# Altium schematic sheet Power.SchDoc: QUTMS Shutdown V2 - Power
size A4; Author: Jonn Dillon; Organization: QUT Motorsport; Address1: O-120; Address2: O Block; Address3: QUT Gardens Point; Address4: Brisbane, 4000; DocumentNumber: 13; SheetNumber: 13; SheetTotal: 13
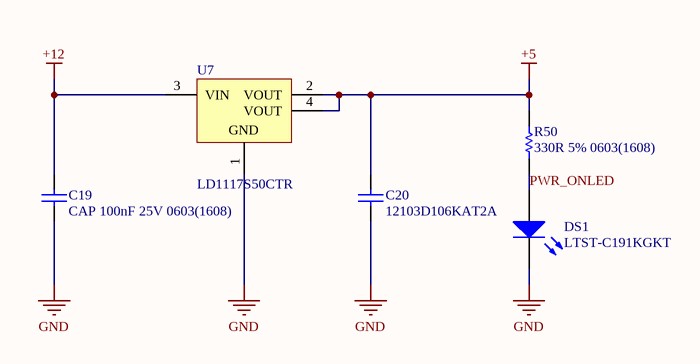
[diagram p0: Power.SchDoc]

## Parts
C19  CAP 100nF 25V 0603(1608)  [CAPC0603(1608)100_N]
C20  12103D106KAT2A  [CAPC3225X279X50LL20T25]
DS1  LTST-C191KGKT  [LITE-ON-LTST-C191KRKT-2_V]
R50  330R 5% 0603(1608)  [RESC0603(1608)_L]
U7  LD1117S50CTR  [SOT-223_N]

## Nets
+5: C20.2 R50.1 U7.2(VOUT) U7.4(VOUT)
+12: C19.2 U7.3(VIN)
GND: C19.1 C20.1 DS1.2(K) U7.1(GND)
PWR_ONLED: DS1.1(A) R50.2

## Notes on the sheet
- Title
- Size:
- Date:
- A4
- Number:
- Time:
- Revision:
- Sheet
- of
- File:

## Library data of the parts
C19 = CMP-1035-02587-1: CAP 100nF 25V ±5% 0603 (1608 Metric) Thickness 1mm SMD; Case-EIA: 0603; Tolerance: Â±5%; Case-Metric: 1608; Technology: SMT; Max Thickness: 1 mm; Rated Voltage: 25 V; Value: 100nF
C20 = CMP-2000-05477-1: Chip Capacitor, 10 uF, +/- 10%, 25 V, -55 to 85 degC, 1210 (3225 Metric), RoHS, Tape and Reel; Manufacturer: AVX; Product Training Modules: ComponentSolutionsforSmartMeterApplications; Capacitance: 10µF; Catalog Drawings: AT2A_1210_2.79; Voltage - Rated: 25V; Other Names: 478-1627-6; Online Catalog: X5RDielectric(D); Temperature Coefficient: X5R; Package Reference: 1210; Lead Style: -; Manufacturer URL: http://www.avx.com/; Datasheet Version: 05/2016; Ratings: -; Mounting Technology: SurfaceMount; Datasheet URL: http://datasheets.avx.com/cx5r.pdf; Package Description: 2-Pin Surface Mount Device, Body 3.2 x 2.5 mm; Applications: GeneralPurpose; Features: -; Tolerance: ±10%; Package / Case: 1210(3225Metric); Lead Spacing: -; Series: -; Mounting Type: SurfaceMount,MLCC; Family: CeramicCapacitors; Standard Package: 1; Category: Capacitors; Packaging: Digi-Reel®; Thickness (Max): 0.110"(2.79mm); Operating Temperature: -55°C~85°C; Size / Dimension: 0.126"Lx0.098"W(3.20mmx2.50mm); Height - Seated (Max): -
DS1 = CMP-2000-05198-1: Chip LED, Green, 574 nm, 40 pF, -55 to 85 degC, 2-Pin SMD, RoHS, Tape and Reel; Manufacturer: Lite-On; Rad Hardened: No; Emitting Color: YellowGreen; Product Height (mm): 0.55mm; Forward Voltage: 2.4V; Number of Elements: 1; Dominant Wave Length: 571nm; DELETED: Compliant; Viewing Angle: 130deg; High Brightness: Yes; Peak Wavelength: 574nm; Type: Uni-Color; Forward Current: 30mA; Product Length (mm): 1.6mm; Luminous Intensity: 35mcd; Test Current (It): 20mA; Chip Material: AlGaInP; Product Depth (mm): 0.8mm; Shape Type: Rectangular; Reverse Voltage: 5V; Power Dissipation: 75W; Pin Count: 2; Lens Dimensions: 1.1X0.8X0.37mm; Packaging: TapeandReel; Main Category: ChipLED; Operating Temperature Classification: Industrial; Package Type: ChipLed; Mounting: SurfaceMount; Lum Intensity: 35mcd; Operating Temp Range: -55Cto85C; Datasheet Version: Jan-07; Datasheet URL: http://download.siliconexpert.com/pdfs/2007/08/26/semi_b/manual/lot/ds/ltst-c191kgkt.pdf; Manufacturer URL: http://www.us.liteon.com/
R50 = CMP-1012-00062-1: 330R 0.1W 5% 0603 (1608 Metric)  SMD; Value: 330.00 Ohm; Case-EIA: 0603; Case-Metric: 1608; Tolerance: 5 %; Power: 0.1 W; Technology: SMT
U7 = CMP-0244-00311-1: Fixed Low Drop Positive Voltage Regulator, 5V, 4-Pin SOT-223, Tape and Reel; PackageReference: SOT-223; PackageVersion: 2010; ComponentLink2URL: http://www.st.com/internet/com/TECHNICAL_RESOURCES/TECHNICAL_LITERATURE/DATASHEET/CD00000544.pdf; ComponentLink1URL: http://www.st.com; ComponentLink2Description: Datasheet; DatasheetVersion: 1/11/2011; ComponentLink1Description: Manufacturer URL; PackageDescription: 4-Pin SOT-223 Package, 6.5 x 3.5 mm Body, 2.3 mm Pitch, 7 mm Lead Span